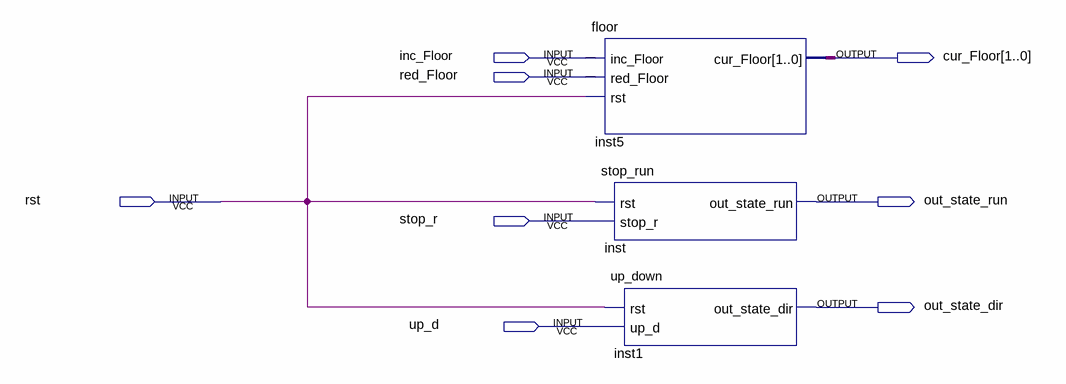
[diagram p0: schematic sheet]
// Quartus schematic data_deal.bdf as structural Verilog: 3 symbols, 8 pins
module data_deal (
  input  inc_Floor,
  input  red_Floor,
  input  rst,
  input  stop_r,
  input  up_d,
  output [1:0] cur_Floor,
  output out_state_run,
  output out_state_dir
);

  floor inst5 (.inc_Floor(inc_Floor), .red_Floor(red_Floor), .rst(rst), .cur_Floor(cur_Floor));
  stop_run inst (.rst(rst), .stop_r(stop_r), .out_state_run(out_state_run));
  up_down inst1 (.rst(rst), .up_d(up_d), .out_state_dir(out_state_dir));
endmodule
